# Altium schematic sheet Magnetometer.SchDoc
size A; SheetNumber: 7
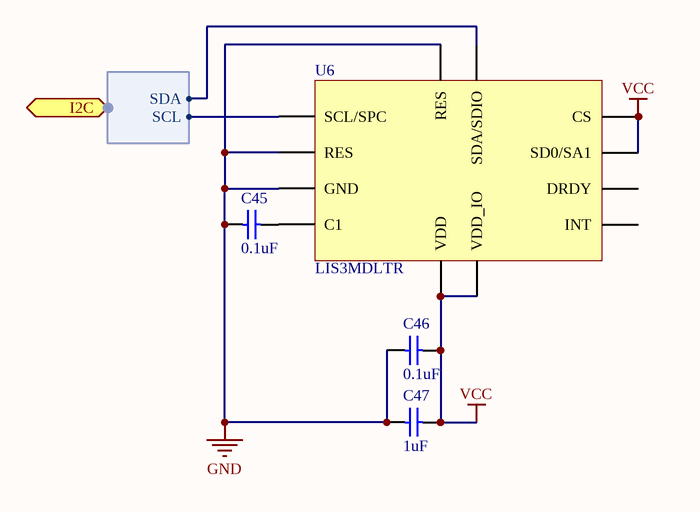
[diagram p0: Magnetometer.SchDoc]

## Parts
C45  value 0.1uF  [C0402[1005X55]]  (hidden comment: 0.1uF 6.3V 0402)
C46  value 0.1uF  [C0402[1005X55]]  (hidden comment: 0.1uF 6.3V 0402)
C47  value 1uF  [C0402[1005X55]]  (hidden comment: 1uF 6.3V 0402)
U6  LIS3MDLTR  [LGA-12 (2x2MM)]

## Ports
I2C (harness I2C)

## Harnesses
I2C: SCL, SDA

## Nets
GND: C45.1 C46.1 C47.1 U6.2(RES) U6.3(GND) U6.12(RES)
VCC: C46.2 C47.2 U6.5(VDD) U6.6(VDD_IO) U6.9(SD0/SA1) U6.10(CS)
NetC45_2: C45.2 U6.4(C1)
NetU6_1: U6.1(SCL/SPC) ; port I2C.SCL
NetU6_11: U6.11(SDA/SDIO) ; port I2C.SDA

Not connected (* = marked no-connect by the designer): U6 7(INT) 8(DRDY)

## Library data of the parts
C45 C46 = CAP_0.1uF_6.3V_0402_10%: 0.1uF 6.3V 10% 0402 (1005 Metric); PartNumber: GRM155R70J104KA01D; Manufacturer: Murata; Mounting Technology: Surface Mount; PackageReference: 0402; PackageDescription: 0402 (1005 Metric); Voltage: 6.3V; Tolerance: 10%
C47 = CAP_1uF_6.3V_0402_10%: 1uF 6.3V 10% 0402 (1005 Metric); PartNumber: GRM155R70J105KA12D; Manufacturer: Murata; Mounting Technology: Surface Mount; PackageReference: 0402; PackageDescription: 0402 (1005 Metric); Voltage: 6.3V; Tolerance: 10%
U6 = LIS3MDLTR: Board Mount Hall Effect / Magnetic Sensors Ultra Lo-Pwr Hi Perf 3-Axis 1.9-3.6V; Manufacturer: STMicroelectronics; PartNumber: LIS3MDLTR; Mounting Technology: Surface Mount; PackageReference: LGA-12